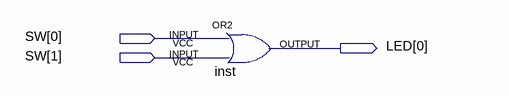
[diagram p0: schematic sheet]
// Quartus schematic task0.bdf as structural Verilog: 1 symbols, 3 pins
module task0 (
  input  [1:0] SW,
  output [0:0] LED
);

  // OR2 inst has open pins: IN1=SW[0], IN2=SW[1], OUT=open
endmodule
